# EAGLE design TS1108 (EAGLE 7.1.0)
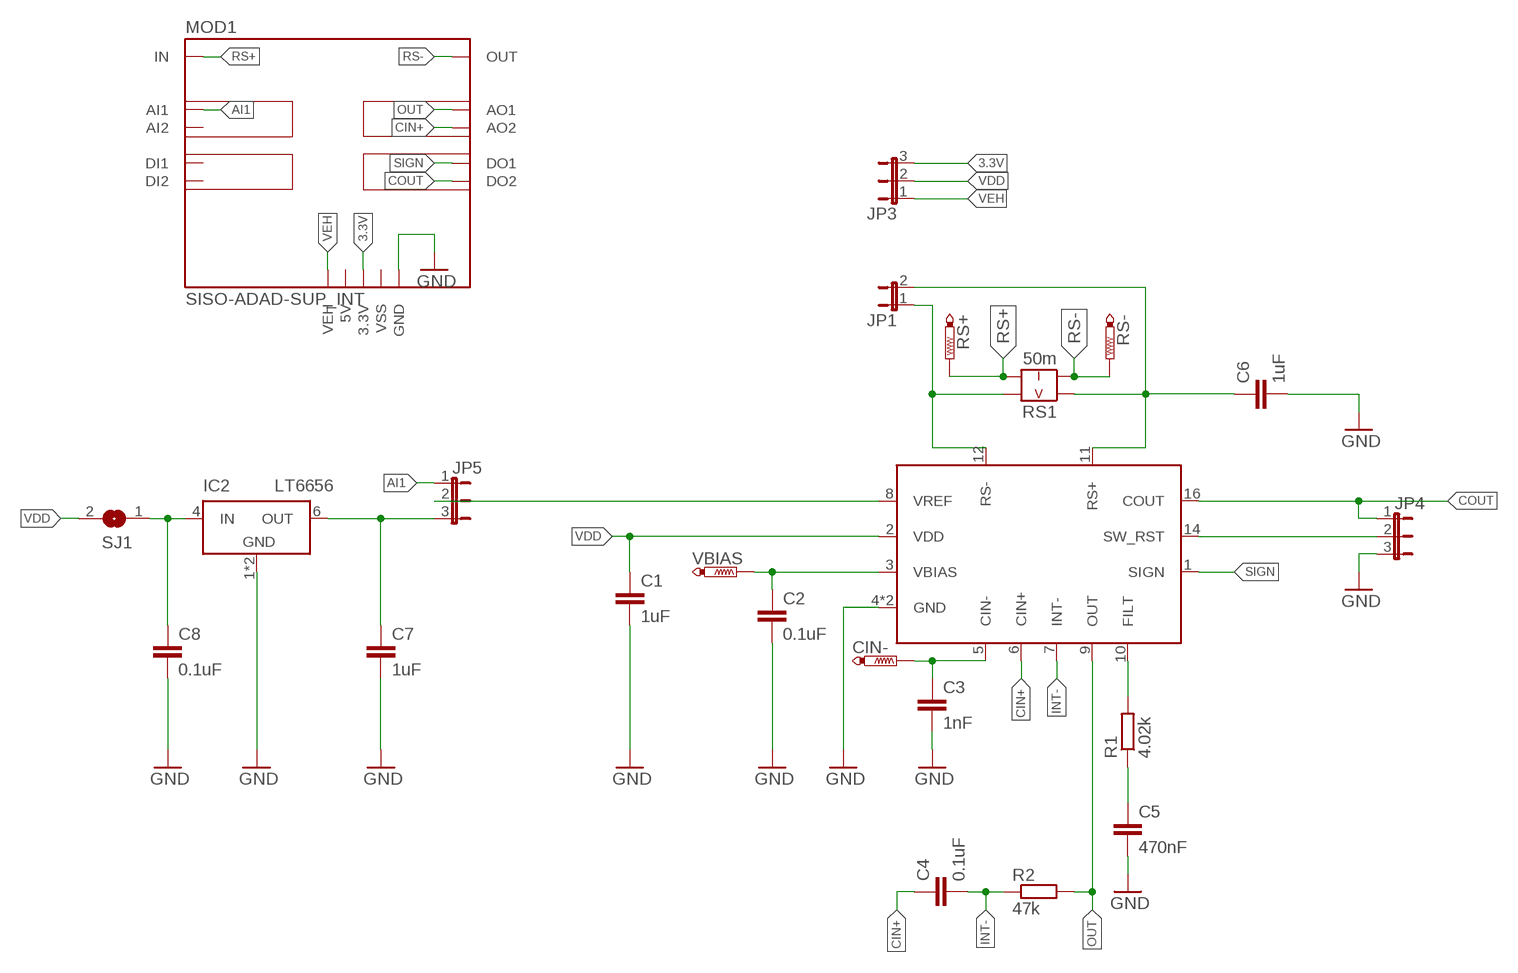
[diagram p0: schematic, sheet 1]

## Parts
C1  1uF  C-EUC0805K  [C0805K]
C2  0.1uF  C-EUC0805K  [C0805K]
C3  1nF  C-EUC0805K  [C0805K]
C4  0.1uF  C-EUC0805K  [C0805K]
C5  470nF  C-EUC0805K  [C0805K]
C6  1uF  C-EUC0805K  [C0805K]
C7  1uF  C-EUC0805K  [C0805K]
C8  0.1uF  C-EUC0805K  [C0805K]
CIN-  PTR1B1,27  [B1,27]
IC1  TS1108  [LFCSP16_WQ_CP-16-33]
IC2  LT6656  [TSOT23-6]
JP1  JP1E  [JP1]
JP3  JP2E  [JP2]
JP4  JP2E  [JP2]
JP5  JP2E  [JP2]
MOD1  SISO-ADAD-SUP_INT  [SISO-ADAD-SUP]
R1  4.02k  R-EU_R0805  [R0805]
R2  47k  R-EU_R0805  [R0805]
RS1  50m  LVK_SERIESR1206  [LVK12]
RS+  PTR1B1,27  [B1,27]
RS-  PTR1B1,27  [B1,27]
SJ1  SJ  [SJ]
VBIAS  PTR1B1,27  [B1,27]

## Nets
3.3V: JP3.3 MOD1.3.3V
AI1: JP5.1 MOD1.AI1
CIN+: C4.1 IC1.6(CIN+) MOD1.AO2
CIN-: C3.1 CIN-.TP IC1.5(CIN-)
COUT: IC1.16(COUT) JP4.1 MOD1.DO2
GND: C1.2 C2.2 C3.2 C5.2 C6.2 C7.2 C8.2 IC1.4(GND) IC1.EXP(GND) IC2.1(GND) IC2.2(GND) JP4.3 MOD1.GND1(GND) MOD1.GND2(GND) MOD1.GND3(GND) MOD1.GND4(GND)
INT-: C4.2 IC1.7(INT-) R2.1
N$1: C2.1 IC1.3(VBIAS) VBIAS.TP
N$3: C7.1 IC2.6(OUT) JP5.3
N$4: C8.1 IC2.4(IN) SJ1.1
N$5: C6.1 IC1.11(RS+) JP1.2 RS1.V1
N$6: IC1.8(VREF) JP5.2
N$7: IC1.10(FILT) R1.2
N$8: C5.1 R1.1
N$10: IC1.14(SW_RST) JP4.2
N$12: IC1.12(RS-) JP1.1 RS1.V2
OUT: IC1.9(OUT) MOD1.AO1 R2.2
RS+: MOD1.IN1(IN) MOD1.IN2(IN) MOD1.IN3(IN) MOD1.IN4(IN) RS1.I2 RS+.TP
RS-: MOD1.OUT1_1(OUT) MOD1.OUT1_2(OUT) MOD1.OUT1_3(OUT) MOD1.OUT1_4(OUT) RS1.I1 RS-.TP
SIGN: IC1.1(SIGN) MOD1.DO1
VDD: C1.1 IC1.2(VDD) JP3.2 SJ1.2
VEH: JP3.1 MOD1.VEH
Unconnected: MOD1.AI2 MOD1.DI1 MOD1.DI2

## Power pins joined to a net without a drawn wire
5V: MOD1.5V
VSS: MOD1.VSS

## Library data of the parts
C1-C8 = rcl:C-EU: CAPACITOR, European symbol
CIN- RS+ RS- VBIAS = testpad:PTR1: TEST PIN
IC1 = TS1108:TS1108
IC2 = LT6656:LT6656
JP1 = jumper:JP1E: JUMPER
JP3-JP5 = Jumper_mod:JP2E: JUMPER
MOD1 = AllModules:SISO-ADAD-SUP_INT
R1 R2 = rcl:R-EU_: RESISTOR, European symbol
RS1 = Resistor-LVK_Series:LVK_SERIES: RESISTOR, European symbol; SPICEPREFIX: R
SJ1 = jumper:SJ: SMD solder JUMPER

## Board
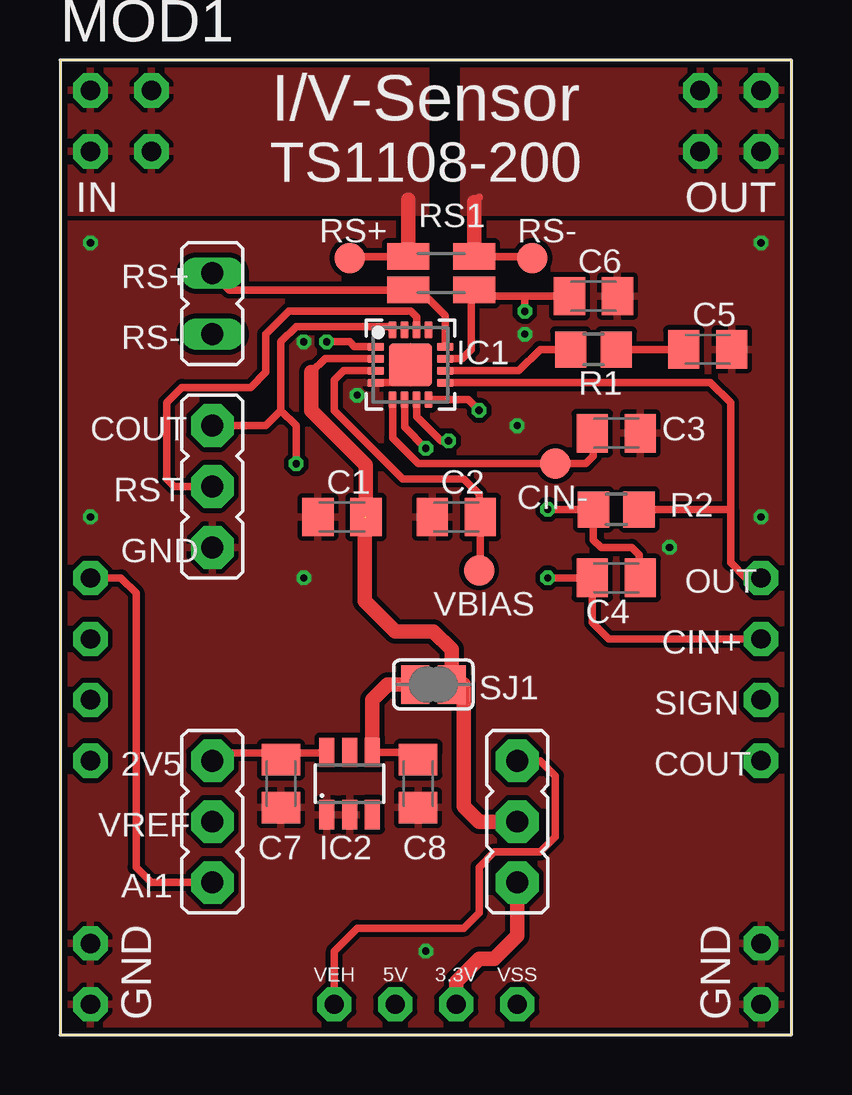
[diagram p1: board, top side]
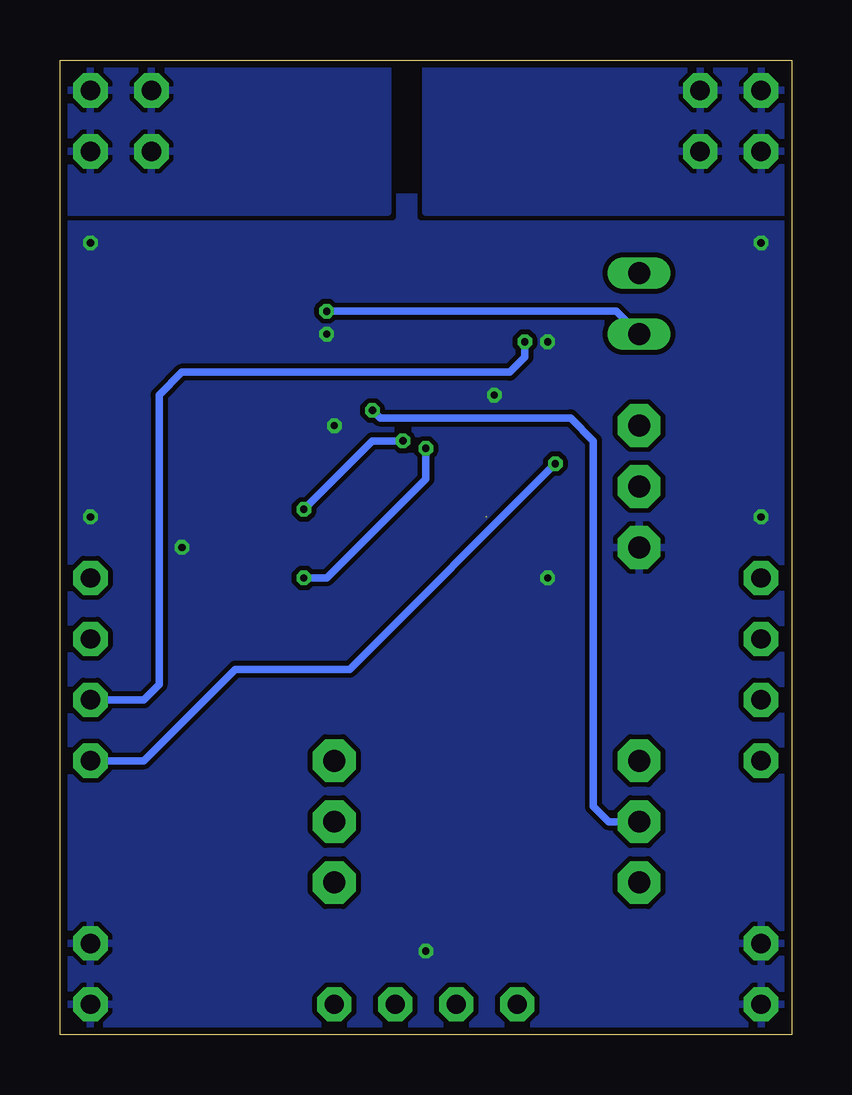
[diagram p2: board, bottom side, seen from below]

Size 30.48 x 40.64 mm. Coordinates in mm from the lower left corner, seen from the top.
Outline: 0,0 30.48,0 30.48,40.64 0,40.64 0,0
Copper layers (1*16): Top 0.035mm / dielectric 1.5mm / Bottom 0.035mm
Design rules "PCB-POOL Standard *": minimum track width 0.15mm, minimum drill 0.3mm, track to track 0.15mm, track to pad 0.15mm, pad to pad 0.15mm, via to via 0.15mm, smd to smd 0.15mm, copper to edge 0.3mm, drill to drill 0.2mm, minimum pad ring 0.2mm, minimum via ring 0.15mm, stop-mask expansion 0.075mm, vias tented up to drill 0mil, thermal gap 0.2mm

### Footprints (pad centres in the part's own frame; a part is rotated, then mirrored left to right if it is on the bottom)
C0805K = smd 1.3 x 1.6: 1 -1,0; 2 1,0
B1,27 = smd 1.27 x 1.27: TP 0,0
LFCSP16_WQ_CP-16-33 = smd 0.7 x 0.34: 1 -1.45,0.75; 2 -1.45,0.25; 3 -1.45,-0.25; 4 -1.45,-0.75; 9 1.45,-0.75; 10 1.45,-0.25; 11 1.45,0.25; 12 1.45,0.75 | smd 0.34 x 0.7: 5 -0.75,-1.45; 6 -0.25,-1.45; 7 0.25,-1.45; 8 0.75,-1.45; 13 0.75,1.45; 14 0.25,1.45; 15 -0.25,1.45; 16 -0.75,1.45 | smd 1.8 x 1.8: EXP 0,0
TSOT23-6 = smd 0.62 x 1.22: 1 -0.95,-1.3; 2 0,-1.3; 3 0.95,-1.3; 4 0.95,1.3; 5 0,1.3; 6 -0.95,1.3
JP1 = drill 0.914 long: 1 0,-1.27; 2 0,1.27
JP2 = drill 0.914 pad 1.778 octagon: 1 -2.54,0; 2 0,0; 3 2.54,0
SISO-ADAD-SUP = drill 0.8 pad 1.422 octagon: 3.3V 15.24,-38.1; 5V 12.7,-38.1; AI1 0,-20.32; AI2 0,-22.86; AO1 27.94,-20.32; AO2 27.94,-22.86; DI1 0,-25.4; DI2 0,-27.94; DO1 27.94,-25.4; DO2 27.94,-27.94; GND1 0,-38.1; GND2 0,-35.56; GND3 27.94,-35.56; GND4 27.94,-38.1; IN1 0,0; IN2 0,-2.54; IN3 2.54,0; IN4 2.54,-2.54; OUT1_1 25.4,0; OUT1_2 25.4,-2.54; OUT1_3 27.94,0; OUT1_4 27.94,-2.54; VEH 10.16,-38.1; VSS 17.78,-38.1
R0805 = smd 1.3 x 1.5: 1 -0.95,0; 2 0.95,0
LVK12 = smd 1.75 x 1.1: I1 -1.378,-0.7; I2 1.372,-0.7; V1 -1.378,0.7; V2 1.372,0.7
SJ = smd 1.168 x 1.6: 1 -0.762,0; 2 0.762,0

### Placement (x,y rotation side)
C1  11.75,21.59 180 top
C2  16.51,21.59 180 top
C3  23.18,25.08 0 top
C4  23.18,19.05 0 top
C5  26.99,28.57 0 top
C6  22.23,30.8 0 top
C7  9.21,10.48 270 top
C8  14.92,10.48 270 top
CIN-  20.64,23.81 0 top
IC1  14.61,27.94 0 top
IC2  12.06,10.48 0 top
JP1  6.35,30.48 180 top
JP3  19.05,8.89 270 top
JP4  6.35,22.86 270 top
JP5  6.35,8.89 90 top
MOD1  1.27,39.37 0 top
R1  22.23,28.57 180 top
R2  23.18,21.91 0 top
RS1  15.88,31.75 180 top
RS+  12.06,32.38 0 top
RS-  19.68,32.38 0 top
SJ1  15.56,14.61 0 top
VBIAS  17.46,19.37 180 top

### Tracks (layer width: path | path; a pad name or v marks a point on that pad's centre or on a via)
3.3V
  Top 0.61: MOD1.3.3V 16.51,2.22 17.46,3.17 18.1,3.17 19.05,4.13 JP3.3
AI1
  Top 0.305: MOD1.AI1 2.54,19.05 3.17,18.41 3.17,6.99 3.81,6.35 JP5.1
CIN+  (via drill 0.3)
  Top 0.305: IC1.6 14.36,25.33 v15.24,24.45 | v20.32,19.05 C4.1 22.18,17.19 22.86,16.51 MOD1.AO2
  Bottom 0.305: v15.24,24.45 15.24,23.18 19.37,19.05 v20.32,19.05
CIN-
  Top 0.305: IC1.5 13.86,24.88 14.92,23.81 CIN-.TP 21.91,23.81 22.23,24.13 22.23,25.04 C3.1
COUT  (via drill 0.3)
  Top 0.305: JP4.1 8.57,25.4 9.21,26.04 | 9.21,26.04 9.21,28.89 9.84,29.53 13.72,29.53 IC1.16 | 9.21,26.04 9.84,25.4 v9.84,23.81
  Bottom 0.305: v9.84,23.81 18.41,15.24 23.18,15.24 26.99,11.43 MOD1.DO2
GND  (via drill 0.3)
  Top 0.305: IC1.4 13.86,27.19 IC1.EXP
  other vias: 15.24,3.49 12.38,26.67 29.21,33.02 25.4,20.32 19.37,29.21 10.16,28.89 1.27,33.02 1.27,21.59 29.21,21.59 19.05,25.4 10.16,19.05
  pour Bottom (isolate 0.203, rank 2): -2.54,34.92 33.02,34.92 33.02,-2.54 -2.54,-2.54
  pour Top (isolate 0.203, rank 2): -1.27,34.92 31.75,34.92 31.75,-1.27 -1.27,-1.27
INT-  (via drill 0.3)
  Top 0.305: IC1.7 14.86,25.79 15.88,24.77 v16.19,24.77 | C4.2 24.13,19.1 24.13,20 23.81,20.32 22.54,20.32 22.23,20.64 R2.1 v20.32,21.91
  Bottom 0.305: v16.19,24.77 17.46,24.77 v20.32,21.91
N$1
  Top 0.305: VBIAS.TP 17.51,19.41 C2.1 17.46,21.64 17.46,22.55 16.83,23.18 14.29,23.18 11.43,26.04 11.43,27.3 11.81,27.69 IC1.3
N$3
  Top 0.305: JP5.3 6.67,11.75 9.84,11.75 10.8,11.75 IC2.6
  Top 0.406: C7.1 9.84,11.75
N$4
  Top 0.305: IC2.4 15.57,11.78 C8.1
  Top 0.61: SJ1.1 13.65,14.61 13.02,13.97 IC2.4
N$5  (via drill 0.3)
  Top 0.305: IC1.11 16.76,28.19 17.14,28.57 17.14,30.94 RS1.V1 | 17.32,31.11 RS1.V1 | RS1.V1 17.51,30.8 19.37,30.8 | 19.37,30.8 C6.1 | v19.37,30.16 19.37,30.8
  Bottom 0.305: JP1.2 7.3,30.16 v19.37,30.16
N$6  (via drill 0.3)
  Top 0.305: v17.46,26.04 17.01,26.49 IC1.8
  Bottom 0.305: JP5.2 7.62,8.89 8.26,9.53 8.26,24.77 9.21,25.72 17.14,25.72 v17.46,26.04
N$7
  Top 0.305: IC1.10 19.12,27.69 20,28.57 R1.2
N$8
  Top 0.305: R1.1 C5.1
N$10
  Top 0.305: JP4.2 4.76,22.86 4.45,23.18 4.45,26.35 5.08,26.99 7.94,26.99 8.57,27.62 8.57,29.21 9.53,30.16 14.61,30.16 14.86,29.91 IC1.14
N$12
  Top 0.305: IC1.12 16.05,29.98 14.92,31.11 14.57,31.11 RS1.V2 7.05,31.05 JP1.1
OUT
  Top 0.305: IC1.9 27.1,27.19 27.94,26.35 27.94,21.91 | 27.94,21.91 27.94,19.68 28.57,19.05 MOD1.AO1 | R2.2 27.94,21.91
RS+
  Top 0.305: 14.61,32.55 RS1.I2 12.13,32.45 RS+.TP | 14.5,34.82 14.61,34.92
  Top 0.61: RS1.I2 14.5,34.82
  pour Bottom: -2.54,42.86 -2.22,34.29 15.24,34.29 15.24,42.86
  pour Top: 15.24,41.91 15.24,34.29 -1.27,34.29 -1.27,41.91
RS-
  Top 0.305: 17.14,32.56 RS1.I1 19.62,32.45 RS-.TP | 17.25,34.72 17.46,34.92
  Top 0.61: RS1.I1 17.25,34.72
  pour Top: 16.83,41.91 16.83,34.29 31.75,34.29 31.75,41.91
  pour Bottom: 16.83,42.86 16.83,34.29 33.02,34.29 33.02,42.86
SIGN  (via drill 0.3)
  Top 0.305: IC1.1 12.27,28.69 12.06,28.89 v11.11,28.89
  Bottom 0.305: v11.11,28.89 11.11,28.26 11.75,27.62 25.4,27.62 26.35,26.67 26.35,14.61 26.99,13.97 MOD1.DO1
VDD  (1 unrouted)
  Top 0.305: IC1.2 11.04,28.19 10.48,27.62
  Top 0.61: JP3.2 17.46,8.89 16.83,9.53 16.83,14.61 SJ1.2 16.32,16.07 15.56,16.83 13.97,16.83 12.7,18.1 12.7,21.59 | 10.48,27.62 10.48,26.04 12.75,23.77 C1.1
VEH
  Top 0.305: MOD1.VEH 11.43,3.49 12.38,4.45 16.83,4.45 17.46,5.08 17.46,6.99 18.1,7.62 20,7.62 20.64,8.26 20.64,10.79 20,11.43 JP3.1

### Text on the board
tNames: I/V-Sensor | TS1108-200 | RS+ | RS- | COUT | RST | GND | OUT | CIN+ | SIGN | 2V5 | COUT | VREF | AI1
tValues: VEH | VDD | 3V3
bStop: by Jagadish & Kokert / 25.04.2017